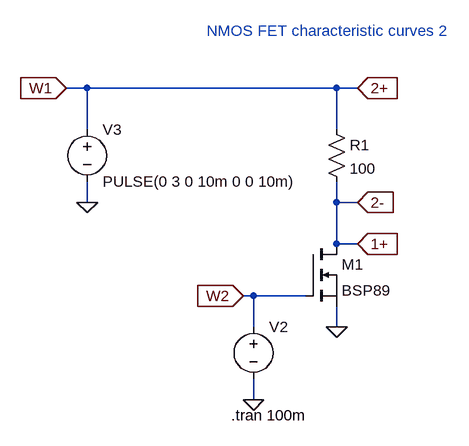
[diagram p0: schematic nmos_curve2.asc]
nmos_curve2.asc, the LTspice schematic file:
Version 4
SHEET 1 880 680
WIRE -464 -128 -496 -128
WIRE -80 -128 -464 -128
WIRE -48 -128 -80 -128
WIRE -464 -64 -464 -128
WIRE -80 -64 -80 -128
WIRE -464 48 -464 16
WIRE -80 48 -80 16
WIRE -48 48 -80 48
WIRE -80 112 -80 48
WIRE -48 112 -80 112
WIRE -208 192 -224 192
WIRE -128 192 -208 192
WIRE -208 240 -208 192
WIRE -80 240 -80 208
WIRE -208 352 -208 320
FLAG -80 240 0
FLAG -208 352 0
FLAG -464 48 0
FLAG -224 192 W2
IOPIN -224 192 In
FLAG -48 -128 2+
IOPIN -48 -128 In
FLAG -48 48 2-
IOPIN -48 48 In
FLAG -496 -128 W1
IOPIN -496 -128 In
FLAG -48 112 1+
IOPIN -48 112 In
SYMBOL nmos -128 112 R0
SYMATTR InstName M1
SYMATTR Value BSP89
SYMBOL res -96 -80 R0
SYMATTR InstName R1
SYMATTR Value 100
SYMBOL voltage -464 -80 R0
WINDOW 123 0 0 Left 0
WINDOW 39 0 0 Left 0
SYMATTR InstName V3
SYMATTR Value PULSE(0 3 0 10m 0 0 10m)
SYMBOL voltage -208 224 R0
WINDOW 3 24 44 Invisible 2
SYMATTR Value PWL REPEAT FOREVER (20m 0.6 20.00000001m 1.2 40m 1.2 40.0000001m 1.8 60m 1.8 60.000001m 2.4 80m 2.4 80.00001m 3 100m 3 100.0000001m 0.6) ENDREPEAT
SYMATTR InstName V2
TEXT -242 376 Left 2 !.tran 100m
TEXT -280 -216 Left 2 ;NMOS FET characteristic curves 2

The netlist it stands for:
* nmos_curve2.asc
M1 1+ W2 0 0 BSP89
R1 W1 1+ 100
V3 W1 0 PULSE(0 3 0 10m 0 0 10m)
V2 W2 0 PWL REPEAT FOREVER (20m 0.6 20.00000001m 1.2 40m 1.2 40.0000001m 1.8 60m 1.8 60.000001m 2.4 80m 2.4 80.00001m 3 100m 3 100.0000001m 0.6) ENDREPEAT
.model NMOS NMOS
.model PMOS PMOS
.lib standard.mos
.tran 100m
* NMOS FET characteristic curves 2
.backanno
.end